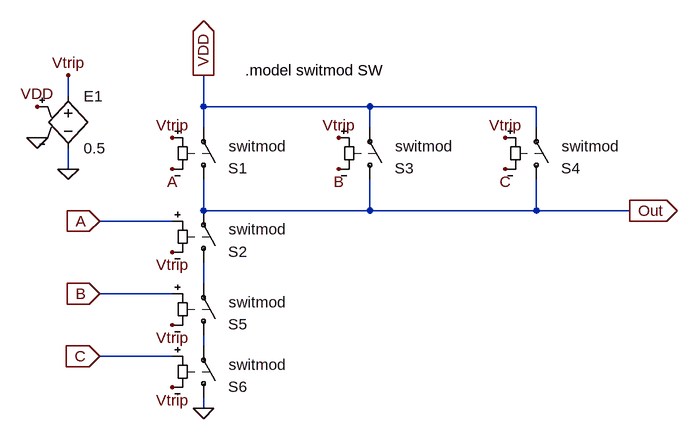
[diagram p0: schematic Ideal_NAND_3.asc]
Ideal_NAND_3.asc, the LTspice schematic file:
Version 4
SHEET 1 6288 680
WIRE 976 -704 976 -736
WIRE 1184 -688 1184 -736
WIRE 1440 -688 1184 -688
WIRE 1696 -688 1440 -688
WIRE 1184 -656 1184 -688
WIRE 1440 -656 1440 -688
WIRE 1696 -656 1696 -688
WIRE 976 -592 976 -624
WIRE 1184 -528 1184 -576
WIRE 1440 -528 1440 -576
WIRE 1440 -528 1184 -528
WIRE 1696 -528 1696 -576
WIRE 1696 -528 1440 -528
WIRE 1840 -528 1696 -528
WIRE 1136 -512 1024 -512
WIRE 1184 -416 1184 -448
WIRE 1136 -400 1024 -400
WIRE 1184 -320 1184 -336
WIRE 1136 -304 1024 -304
WIRE 1184 -224 1184 -240
FLAG 1024 -512 A
IOPIN 1024 -512 In
FLAG 1184 -736 VDD
IOPIN 1184 -736 Out
FLAG 1184 -224 0
FLAG 1840 -528 Out
IOPIN 1840 -528 Out
FLAG 976 -592 0
FLAG 928 -640 0
FLAG 928 -688 VDD
FLAG 976 -736 Vtrip
FLAG 1136 -592 A
FLAG 1392 -592 B
FLAG 1024 -400 B
IOPIN 1024 -400 In
FLAG 1648 -592 C
FLAG 1024 -304 C
IOPIN 1024 -304 In
FLAG 1648 -640 Vtrip
FLAG 1392 -640 Vtrip
FLAG 1136 -640 Vtrip
FLAG 1136 -464 Vtrip
FLAG 1136 -352 Vtrip
FLAG 1136 -256 Vtrip
SYMBOL sw 1184 -560 M180
WINDOW 3 24 -12 Left 0
WINDOW 38 39 67 Left 0
WINDOW 0 38 33 Left 0
SYMATTR Value ""
SYMATTR SpiceModel switmod
SYMATTR InstName S1
SYMBOL sw 1184 -432 M180
WINDOW 3 24 -12 Left 0
WINDOW 38 39 67 Left 0
WINDOW 0 38 33 Left 0
SYMATTR Value ""
SYMATTR SpiceModel switmod
SYMATTR InstName S2
SYMBOL e 976 -720 R0
SYMATTR InstName E1
SYMATTR Value 0.5
SYMBOL sw 1440 -560 M180
WINDOW 3 24 -12 Left 0
WINDOW 38 39 67 Left 0
WINDOW 0 38 33 Left 0
SYMATTR Value ""
SYMATTR SpiceModel switmod
SYMATTR InstName S3
SYMBOL sw 1696 -560 M180
WINDOW 3 24 -12 Left 0
WINDOW 38 39 67 Left 0
WINDOW 0 38 33 Left 0
SYMATTR Value ""
SYMATTR SpiceModel switmod
SYMATTR InstName S4
SYMBOL sw 1184 -320 M180
WINDOW 3 24 -12 Left 0
WINDOW 38 39 67 Left 0
WINDOW 0 38 33 Left 0
SYMATTR Value ""
SYMATTR SpiceModel switmod
SYMATTR InstName S5
SYMBOL sw 1184 -224 M180
WINDOW 3 24 -12 Left 0
WINDOW 38 39 67 Left 0
WINDOW 0 38 33 Left 0
SYMATTR Value ""
SYMATTR SpiceModel switmod
SYMATTR InstName S6
TEXT 1248 -744 Left 0 !.model switmod SW

The netlist it stands for:
* Ideal_NAND_3.asc
S1 Out VDD Vtrip A switmod
S2 N001 Out A Vtrip switmod
E1 Vtrip 0 VDD 0 0.5
S3 Out VDD Vtrip B switmod
S4 Out VDD Vtrip C switmod
S5 N002 N001 B Vtrip switmod
S6 0 N002 C Vtrip switmod
.model switmod SW
.backanno
.end